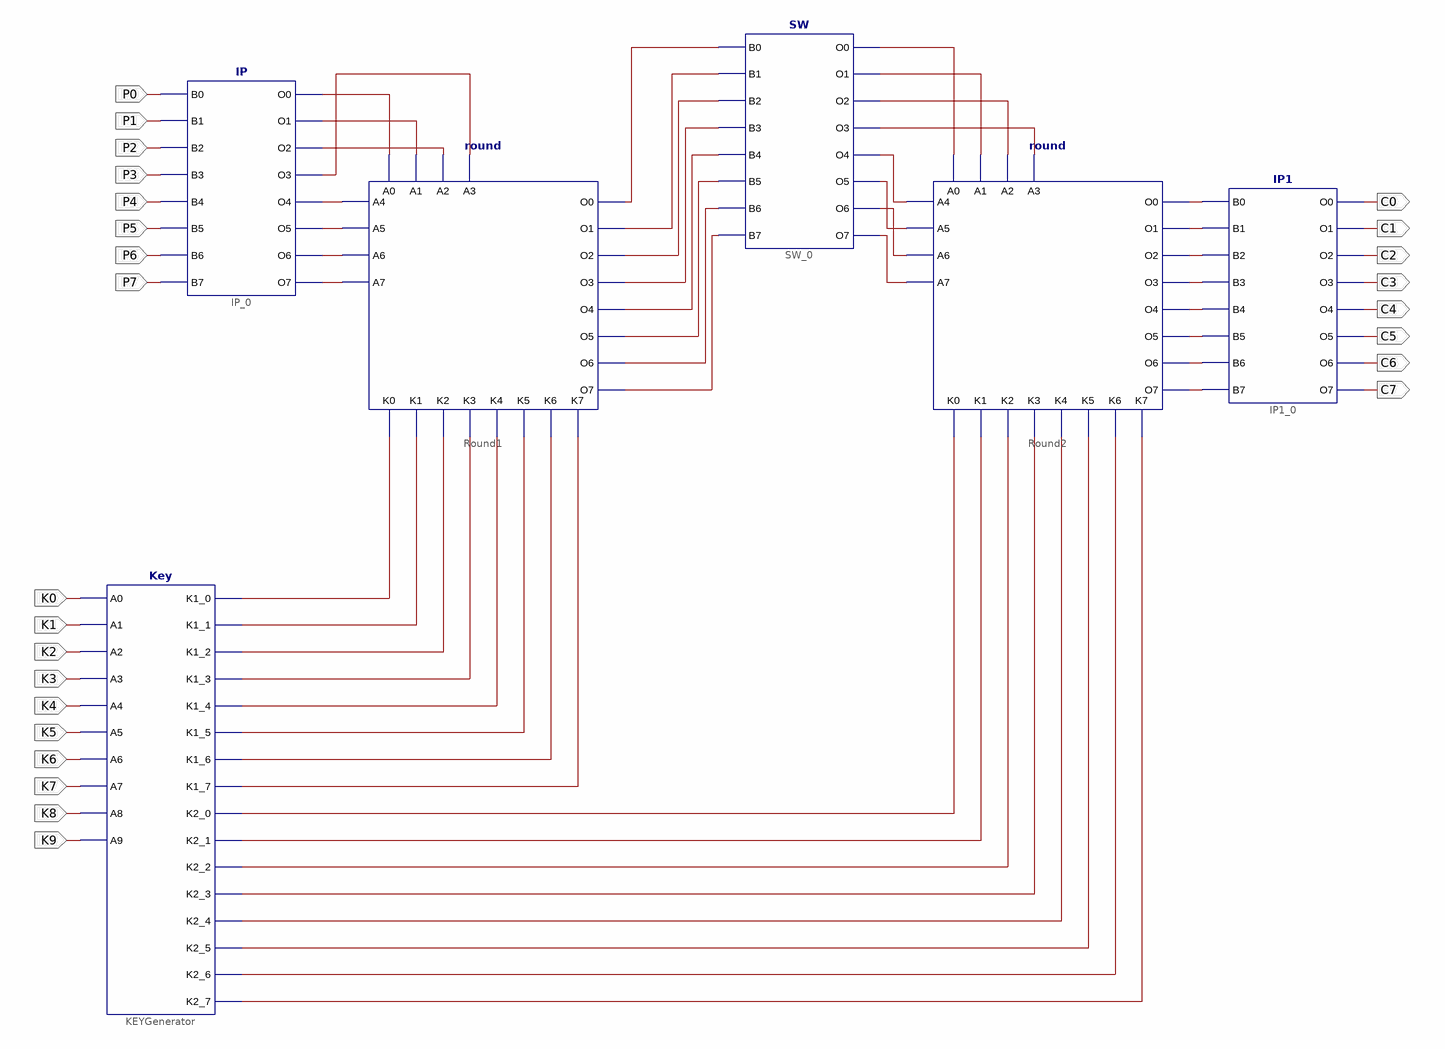
[diagram p0: schematic sheet 1]
// Xilinx ISE schematic Encrypt.sch (xc9500xl) as structural Verilog: 6 symbols, 26 ports
module Encrypt (
  input  K0,
  input  K1,
  input  K2,
  input  K3,
  input  K4,
  input  K5,
  input  K6,
  input  K7,
  input  K8,
  input  K9,
  input  P0,
  input  P1,
  input  P2,
  input  P3,
  input  P4,
  input  P5,
  input  P6,
  input  P7,
  output C0,
  output C1,
  output C2,
  output C3,
  output C4,
  output C5,
  output C6,
  output C7
);

  wire XLXN_9, XLXN_10, XLXN_11, XLXN_12, XLXN_13, XLXN_14, XLXN_15, XLXN_16, XLXN_17, XLXN_18, XLXN_19,
       XLXN_20, XLXN_21, XLXN_22, XLXN_23, XLXN_24, XLXN_25, XLXN_26, XLXN_27, XLXN_28, XLXN_108, XLXN_109,
       XLXN_110, XLXN_111, XLXN_113, XLXN_114, XLXN_115, XLXN_116, XLXN_126, XLXN_127, XLXN_128, XLXN_129,
       XLXN_130, XLXN_131, XLXN_132, XLXN_151, XLXN_152, XLXN_153, XLXN_155, XLXN_166, XLXN_239, XLXN_240,
       XLXN_241, XLXN_242, XLXN_243, XLXN_244, XLXN_245, XLXN_246;

  Key KEYGenerator (
    .A0(K0), .A1(K1), .A2(K2), .A3(K3), .A4(K4), .A5(K5), .A6(K6), .A7(K7), .A8(K8), .A9(K9), .K1_0(XLXN_17),
    .K1_1(XLXN_18), .K1_2(XLXN_19), .K1_3(XLXN_20), .K1_4(XLXN_21), .K1_5(XLXN_22), .K1_6(XLXN_23),
    .K1_7(XLXN_24), .K2_0(XLXN_108), .K2_1(XLXN_109), .K2_2(XLXN_110), .K2_3(XLXN_111), .K2_4(XLXN_113),
    .K2_5(XLXN_114), .K2_6(XLXN_115), .K2_7(XLXN_116));
  IP IP_0 (
    .B0(P0), .B1(P1), .B2(P2), .B3(P3), .B4(P4), .B5(P5), .B6(P6), .B7(P7), .O0(XLXN_151), .O1(XLXN_152),
    .O2(XLXN_153), .O3(XLXN_155), .O4(XLXN_25), .O5(XLXN_26), .O6(XLXN_27), .O7(XLXN_28));
  round Round1 (
    .A0(XLXN_151), .A1(XLXN_152), .A2(XLXN_153), .A3(XLXN_155), .A4(XLXN_25), .A5(XLXN_26), .A6(XLXN_27),
    .A7(XLXN_28), .K0(XLXN_17), .K1(XLXN_18), .K2(XLXN_19), .K3(XLXN_20), .K4(XLXN_21), .K5(XLXN_22),
    .K6(XLXN_23), .K7(XLXN_24), .O0(XLXN_166), .O1(XLXN_126), .O2(XLXN_127), .O3(XLXN_128), .O4(XLXN_129),
    .O5(XLXN_130), .O6(XLXN_131), .O7(XLXN_132));
  round Round2 (
    .A0(XLXN_246), .A1(XLXN_245), .A2(XLXN_244), .A3(XLXN_243), .A4(XLXN_239), .A5(XLXN_240), .A6(XLXN_241),
    .A7(XLXN_242), .K0(XLXN_108), .K1(XLXN_109), .K2(XLXN_110), .K3(XLXN_111), .K4(XLXN_113), .K5(XLXN_114),
    .K6(XLXN_115), .K7(XLXN_116), .O0(XLXN_9), .O1(XLXN_10), .O2(XLXN_11), .O3(XLXN_12), .O4(XLXN_13),
    .O5(XLXN_14), .O6(XLXN_15), .O7(XLXN_16));
  SW SW_0 (
    .B0(XLXN_166), .B1(XLXN_126), .B2(XLXN_127), .B3(XLXN_128), .B4(XLXN_129), .B5(XLXN_130), .B6(XLXN_131),
    .B7(XLXN_132), .O0(XLXN_246), .O1(XLXN_245), .O2(XLXN_244), .O3(XLXN_243), .O4(XLXN_239), .O5(XLXN_240),
    .O6(XLXN_241), .O7(XLXN_242));
  IP1 IP1_0 (
    .B0(XLXN_9), .B1(XLXN_10), .B2(XLXN_11), .B3(XLXN_12), .B4(XLXN_13), .B5(XLXN_14), .B6(XLXN_15),
    .B7(XLXN_16), .O0(C0), .O1(C1), .O2(C2), .O3(C3), .O4(C4), .O5(C5), .O6(C6), .O7(C7));
endmodule
